# Altium schematic sheet DC.schdoc
size 294 x 133 mm; SheetNumber: 1; SheetTotal: 1
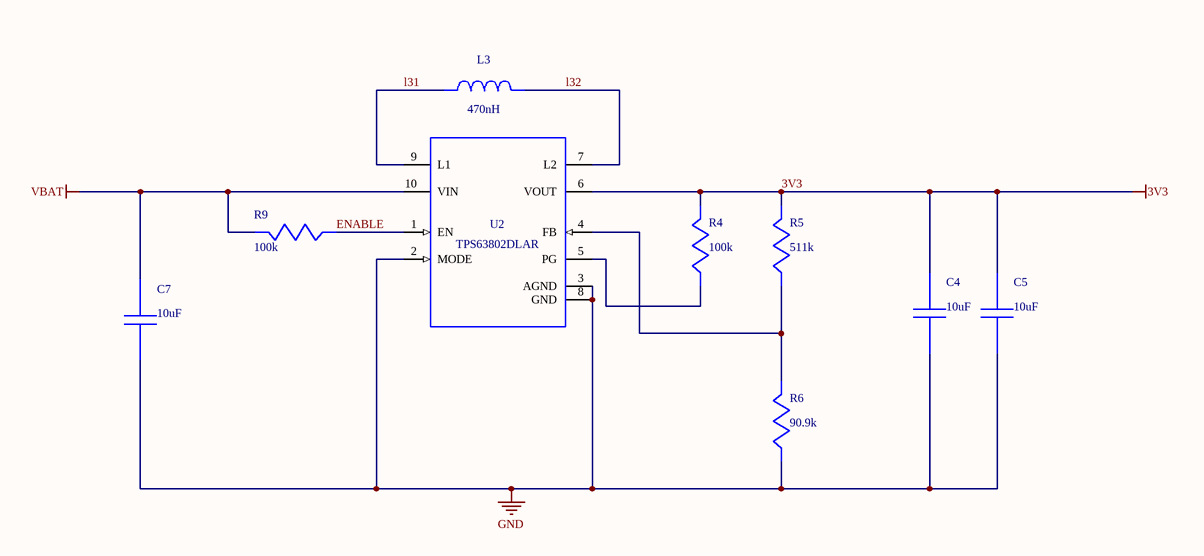
[diagram p0: DC.schdoc]

## Parts
C4  value 10uF  [0603]  (hidden comment: GRM21BR60J226ME39L)
C5  value 10uF  [0603]  (hidden comment: GRM21BR60J226ME39L)
C7  value 10uF  [0603]  (hidden comment: GENERIC_CAPACITOR)
L3  value 470nH  [0603]  (hidden comment: XEL3520-471ME)
R4  value 100k  [0402]  (hidden comment: CRCW0402100KFKED)
R5  value 511k  [0402]  (hidden comment: CRCW0402511KFKED)
R6  value 90.9k  [0402]  (hidden comment: CRCW040290K9FKED)
R9  value 100k  [0402]  (hidden comment: CRCW0402100KFKED)
U2  TPS63802DLAR  [DLA0010A]

## Nets
3V3: C4.1 C5.1 R4.1 R5.1 U2.6(VOUT)
GND: C4.2 C5.2 C7.2 R6.2 U2.2(MODE) U2.3(AGND) U2.8(GND)
VBAT: C7.1 R9.1 U2.10(VIN)
ENABLE: R9.2 U2.1(EN)
l31: L3.2 U2.9(L1)
l32: L3.1 U2.7(L2)
NetR4_2: R4.2 U2.5(PG)
NetR5_2: R5.2 R6.1 U2.4(FB)

## Library data of the parts
C4 C5 = GRM21BR60J226ME39L: GRM21BR60J226ME3; Manufacturer Name: MuRata; PackageReference: GRM21BR60J226ME39L; Manufacturer Part Number: GRM21BR60J226ME39L
C7 = GENERIC_CAPACITOR: CUSTOM1; Manufacturer Name: CUSTOM; PackageReference: CUSTOM; Manufacturer Part Number: GENERIC_CAPACITOR
L3 = XEL3520-471ME: Manufacturer Name: Coilcraft; PackageReference: XEL3520-471ME; Manufacturer Part Number: XEL3520-471ME
R4 R9 = CRCW0402100KFKED: Manufacturer Name: Vishay-Dale; PackageReference: CRCW0402100KFKED; Manufacturer Part Number: CRCW0402100KFKED
R5 = CRCW0402511KFKED: Manufacturer Name: Vishay-Dale; PackageReference: CRCW0402511KFKED; Manufacturer Part Number: CRCW0402511KFKED
R6 = CRCW040290K9FKED: Manufacturer Name: Vishay-Dale; PackageReference: CRCW040290K9FKED; Manufacturer Part Number: CRCW040290K9FKED
U2 = TPS63802DLAR: Manufacturer Name: Texas Instruments; PackageReference: TPS63802DLAR; Manufacturer Part Number: TPS63802DLAR; Value: N/A